# Altium schematic sheet modFOC-ESC-Interface.SchDoc: modFOC-ESC-Interface
size A4; Author: Thomas Hofmann; CompanyName: HTL St. Pölten; Organization: Altium Limited; Address1: modFOC; Address2: Frenchs Forest; Address3: NSW; Address4: Australia 2086; DocumentNumber: 8; Revision: 2.0; SheetNumber: 2; SheetTotal: 7
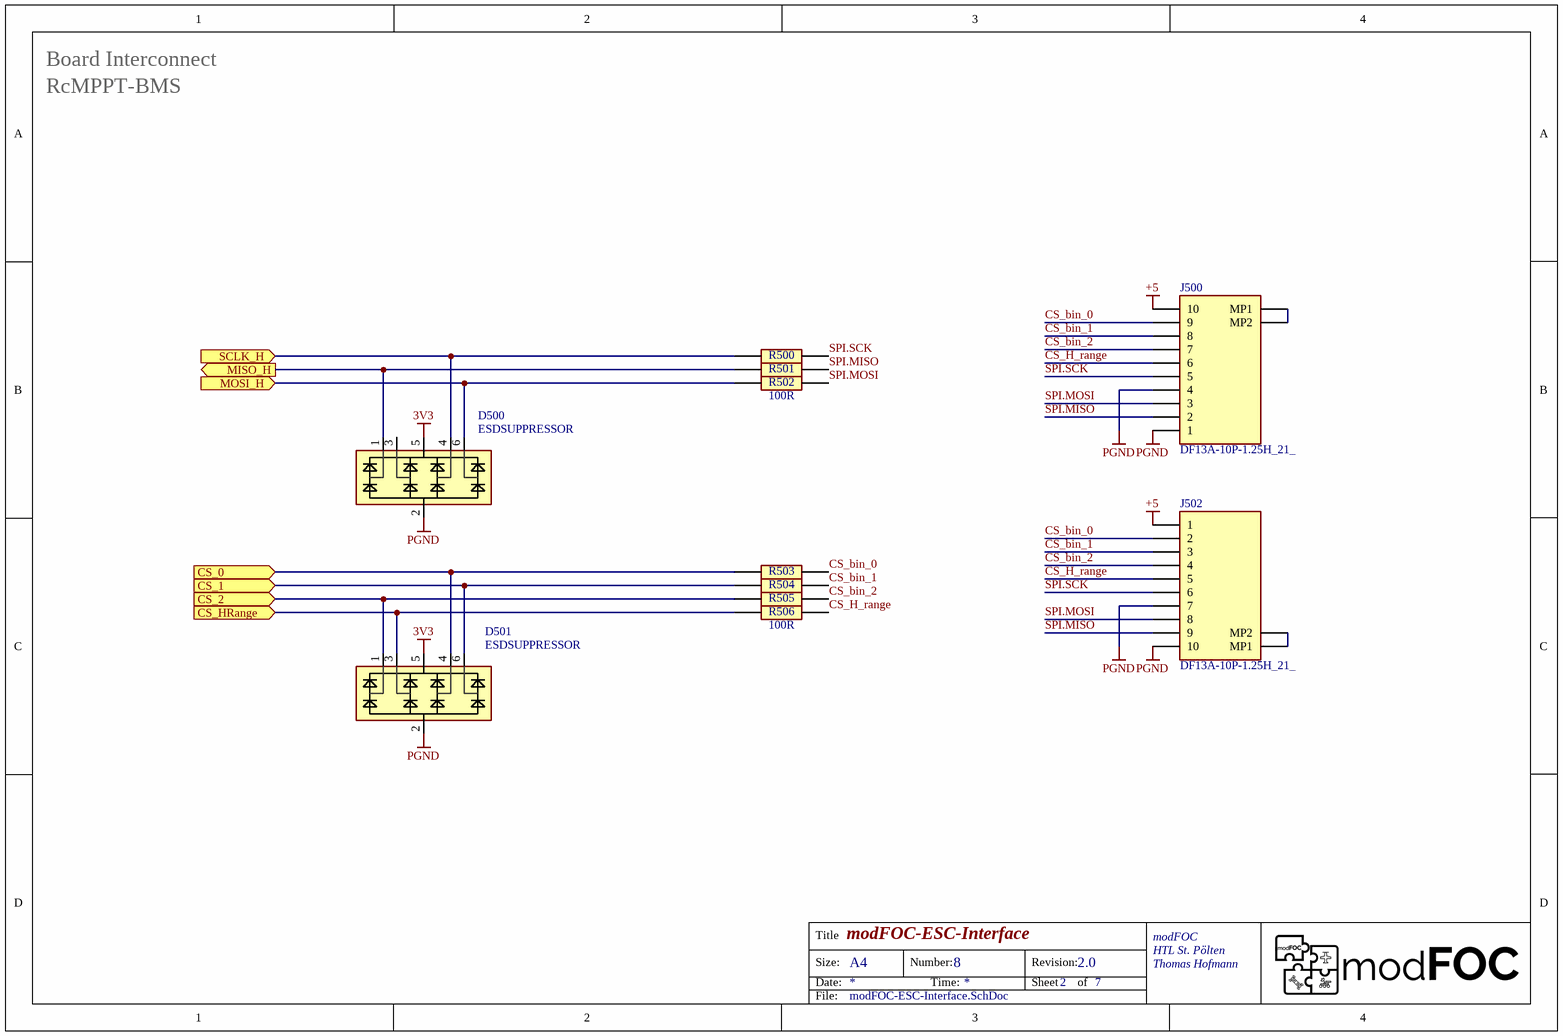
[diagram p0: modFOC-ESC-Interface.SchDoc]

## Parts
D500  ESDSUPPRESSOR  [SOT23-6]
D501  ESDSUPPRESSOR  [SOT23-6]
J500  DF13A-10P-1.25H_21_  [DF13A10P125H21]
J502  DF13A-10P-1.25H_21_  [DF13A10P125H21]
R500  100R  [RESC1005X40N]  (value not drawn)
R501  100R  [RESC1005X40N]  (value not drawn)
R502  100R  [RESC1005X40N]
R503  100R  [RESC1005X40N]  (value not drawn)
R504  100R  [RESC1005X40N]  (value not drawn)
R505  100R  [RESC1005X40N]  (value not drawn)
R506  100R  [RESC1005X40N]

## Ports
CS_0 (in), CS_1 (in), CS_2 (in), CS_HRange (in), MISO_H (out), MOSI_H (in), SCLK_H (in)

## Nets
3V3: D500.5(VDD) D501.5(VDD)
+5: J500.10 J502.1
PGND: D500.2(GND) D501.2(GND) J500.1 J500.4 J502.7 J502.10
CS_0: D501.4(CH3) R503.1 ; port CS_0
CS_1: D501.6(CH4) R504.1 ; port CS_1
CS_2: D501.1(CH1) R505.1 ; port CS_2
CS_bin_0: J500.9 J502.2 R503.2
CS_bin_1: J500.8 J502.3 R504.2
CS_bin_2: J500.7 J502.4 R505.2
CS_H_range: J500.6 J502.5 R506.2
CS_HRange: D501.3(CH2) R506.1 ; port CS_HRange
MISO_H: D500.1(CH1) R501.1 ; port MISO_H
MOSI_H: D500.6(CH4) R502.1 ; port MOSI_H
SCLK_H: D500.4(CH3) R500.1 ; port SCLK_H
SPI.MISO: J500.2 J502.9 R501.2
SPI.MOSI: J500.3 J502.8 R502.2
SPI.SCK: J500.5 J502.6 R500.2
NetJ500_MP1: J500.MP1 J500.MP2
NetJ502_MP1: J502.MP1 J502.MP2

Not connected (* = marked no-connect by the designer): D500 3(CH2)

## Notes on the sheet
- Board Interconnect
- RcMPPT-BMS
- Title
- Size:
- Date:
- A4
- Number:
- Time:
- Revision:
- Sheet
- of
- File:

## Library data of the parts
D500 D501 = ESDSUPPRESSOR: TVS Diode Array; Height: 0.6mm
J500 J502 = DF13A-10P-1.25H_21_: 10Pin DF13 Connector; Manufacturer_Name: Hirose; Manufacturer_Part_Number: DF13A-10P-1.25H(21); Datasheet Link: https://datasheet.datasheetarchive.com/originals/dk/DKDS-30/590349.pdf; Height: 3.75mm; Mouser Part Number: 798-DF13A10P125H21; Mouser Price/Stock: https://www.mouser.co.uk/ProductDetail/Hirose-Connector/DF13A-10P-125H21?qs=XQjbzJWzFPV7pEVOeMnY%2FQ%3D%3D; Arrow Part Number: DF13A-10P-1.25H(21); Arrow Price/Stock: https://www.arrow.com/en/products/df13a-10p-1.25h-21/hirose-electric
R500-R506 = R0402: Resistor; Height: 0.4mm